# EAGLE design PCB-DISP128x32 (EAGLE 7.1.0)

## Sheet 1 of 2
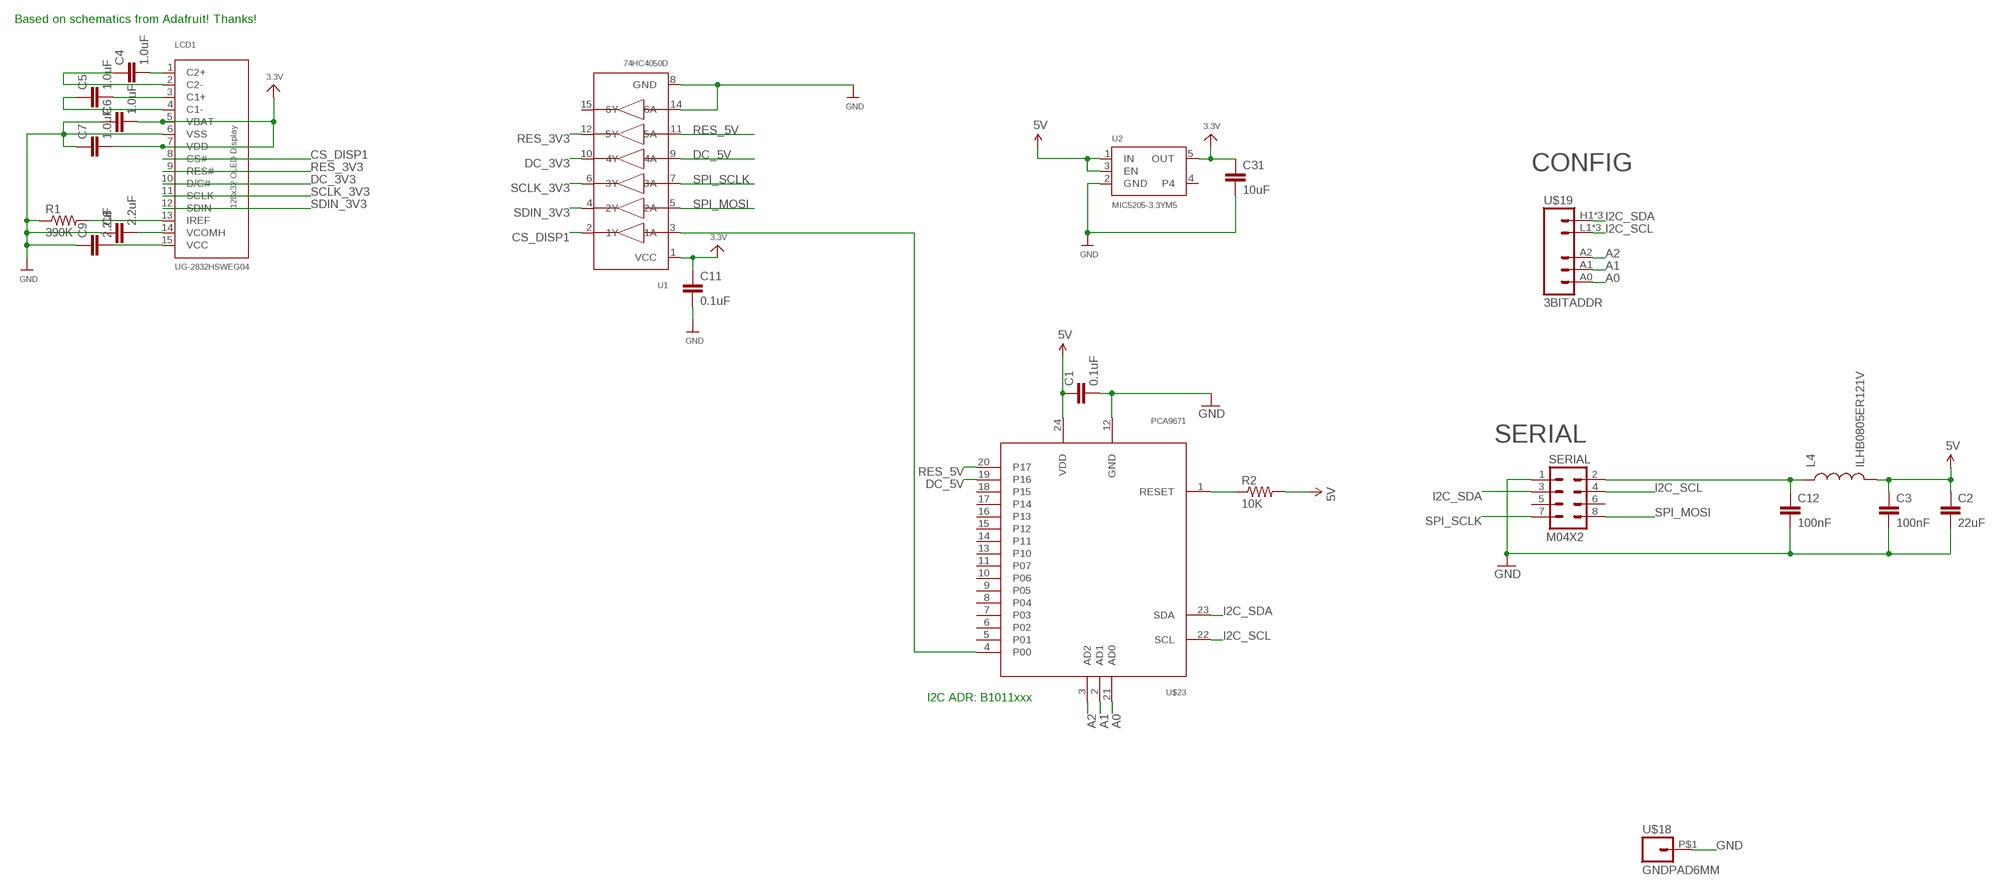
[diagram p0: schematic, sheet 1]

### Parts
C1  0.1uF  CAP0603-CAP  [0603-CAP]
C2  22uF  CAP0805  [0805]
C3  100nF  CAP0603-CAP  [0603-CAP]
C4  1.0uF  CAP0603-CAP  [0603-CAP]
C5  1.0uF  CAP0603-CAP  [0603-CAP]
C6  1.0uF  CAP0603-CAP  [0603-CAP]
C7  1.0uF  CAP0603-CAP  [0603-CAP]
C8  2.2uF  CAP0603-CAP  [0603-CAP]
C9  2.2uF  CAP0603-CAP  [0603-CAP]
C11  0.1uF  CAP0603-CAP  [0603-CAP]
C12  100nF  CAP0603-CAP  [0603-CAP]
C31  10uF  CAP0805  [0805]
L4  ILHB0805ER121V  INDUCTOR0805  [0805]
LCD1  UG-2832HSWEG04  OLED_UG-2832HSWEG04WRAPAROUND  [UG-2832HSWEG04_WRAPAROUND]
R1  390K  RESISTOR0603-RES  [0603-RES]
R2  10K  RESISTOR0603-RES  [0603-RES]
SERIAL  M04X2  [2X4]
U1  74HC4050D  74HC4050DTSSOP16  [TSSOP16]
U2  MIC5205-3.3YM5  VREG_SOT23-5  [SOT23-5]
U$18  GNDPAD6MM  [3.2MMPAD6MM]
U$19  3BITADDR  [3BITADDR]
U$23  PCA9671  [TSSOP24]

### Nets
3.3V [Power]: C6.2 C7.2 C11.1 C31.1 LCD1.5(VBAT) LCD1.7(VDD) U1.1(VCC) U2.5(OUT)
5V [Power]: C1.1 C2.1 C3.1 L4.2 R2.2 U2.1(IN) U2.3(EN) U$23.24(VDD)
A0: U$19.A0 U$23.21(AD0)
A1: U$19.A1 U$23.2(AD1)
A2: U$19.A2 U$23.3(AD2)
ARD_5V [Power]: C12.1 L4.1 SERIAL.2
CS_DISP1: LCD1.8(CS#) U1.2(1Y)
DC_3V3: LCD1.10(D/C#) U1.10(4Y)
DC_5V: U1.9(4A) U$23.19(P16)
GND [Power]: C1.2 C2.2 C3.2 C6.1 C7.1 C8.1 C9.1 C11.2 C12.2 C31.2 LCD1.6(VSS) R1.1 SERIAL.1 U1.8(GND) U1.14(6A) U2.2(GND) U$18.P$1 U$23.12(GND)
I2C_SCL: SERIAL.4 U$19.L1(GND) U$19.L2(GND) U$19.L3(GND) U$23.22(SCL)
I2C_SDA: SERIAL.3 U$19.H1(VCC) U$19.H2(VCC) U$19.H3(VCC) U$23.23(SDA)
N$1: R2.1 U$23.1(RESET)
N$2: C4.1 LCD1.2(C2-)
N$3: C4.2 LCD1.1(C2+)
N$4: C5.1 LCD1.4(C1-)
N$5 [Power]: U1.3(1A) U$23.4(P00)
N$7: C5.2 LCD1.3(C1+)
N$8: LCD1.13(IREF) R1.2
N$9: C8.2 LCD1.14(VCOMH)
N$28: C9.2 LCD1.15(VCC)
RES_3V3: LCD1.9(RES#) U1.12(5Y)
RES_5V: U1.11(5A) U$23.20(P17)
SCLK_3V3: LCD1.11(SCLK) U1.6(3Y)
SDIN_3V3: LCD1.12(SDIN) U1.4(2Y)
SPI_MOSI: SERIAL.8 U1.5(2A)
SPI_SCLK: SERIAL.7 U1.7(3A)
Unconnected: SERIAL.5 SERIAL.6 U1.15(6Y) U2.4 U$23.5(P01) U$23.6(P02) U$23.7(P03) U$23.8(P04) U$23.9(P05) U$23.10(P06) U$23.11(P07) U$23.13(P10) U$23.14(P11) U$23.15(P12) U$23.16(P13) U$23.17(P14) U$23.18(P15)

### Notes on the sheet
- Based on schematics from Adafruit! Thanks!
- CONFIG
- SERIAL
- I2C ADR: B1011xxx

## Sheet 2 of 2

## Library data of the parts
C1-C9 C11 C12 C31 = SparkFun:CAP: Capacitor Standard 0603 ceramic capacitor, and 0.1" leaded capacitor.
L4 = SparkFun:INDUCTOR: Inductors Basic Inductor/Choke - 0603 and 1206. Footprints are not proven and vary greatly between part numbers.
LCD1 = microbuilder:OLED_UG-2832HSWEG04: 128x32 SPI 0.91" Monochrome OLED Display
R1 R2 = SparkFun:RESISTOR: Resistor Basic schematic elements and footprints for 0603, 1206, and PTH resistors.
SERIAL = SparkFun:M04X2
U1 = SKAARHOJ:74HC4050D: 6-channel level shifter 74HC4050D - 2V-6V Supply Digikey: 74HC4050D,653-ND Mouser: 771-74HC4050D-T
U2 = microbuilder:VREG_SOT23-5: SOT23-5 Fixed Voltage Regulators To better organise some of the SOT23-5 fixed voltage regulators in this library, this new part was created. Part Current Out V Out V In V Dropout Digikey Part No. ADP121 150mA 3.3V 3.4-5.5V 0.09V @ 150mA ADP121-AUJZ33R7CT-ND ADP121 150mA 3.0V 3.1-5.5V 0.09V @ 150mA ADP121-AUJZ30R7CT-ND ADP122 300mA 3.3V 3.4-5.5V 0.085V @ 300mA ADP122AUJZ-3.3-R7CT-ND ADP1712 300mA 3.3V 3.5-5.5V 0.17V @ 300mA ADP1712AUJZ-3.3-R7TR-ND AP7311 (Low Cost) 150mA 3.3V 3.5-6V 0.15V @ 150mA AP7311-33WG-7DICT-ND LD39015M18R 150mA 1.8V 1.9V-5.5V 0.08V @ 100mA 497-6977-1-ND MCP1824T-3302E/OT 300mA 3.3V 3.5V-6V 0.2V @ 300mA MCP1824T-3302E/OTCT-ND MIC5205-2.5YM5 TR 150mA 2.5V 2.7-16V 0.165V @ 150mA 576-1257-2-ND MIC5205-3.0YM5 TR 150mA 3.0V 3.2V-16V 0.165V @ 150mA 576-1258-2-ND MIC5205-3.3YM5 TR 150mA 3.3V 3.5V-16V 0.165V @ 150mA 576-1259-2-ND TPS780330220 150mA 3.3V+2.2V 3.6-5.5V 250mV Max 296-23332-1-ND TDA3663/N1,135 100mA 3.3V 3.5-45V 0.18V @ 50mA 568-5343-1-ND
U$18 = SKAARHOJ:GNDPAD
U$19 = SKAARHOJ:3BITADDR
U$23 = SKAARHOJ:PCA9671

## Net classes
0 default: width 0.203 mm, drill 0.406 mm, clearance 0.152 mm
1 Power: width 0.406 mm, drill 0.61 mm, clearance 0.203 mm

## Board
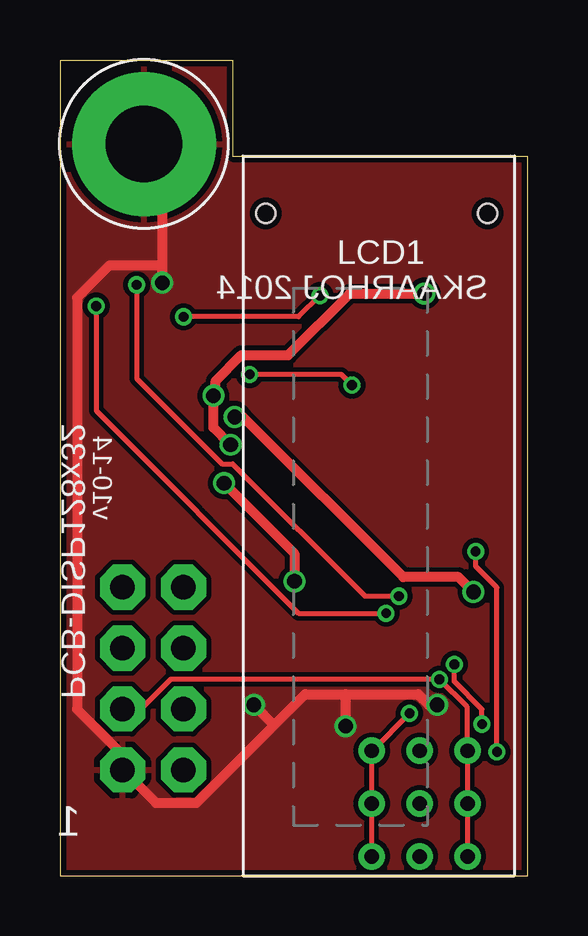
[diagram p1: board, top side]
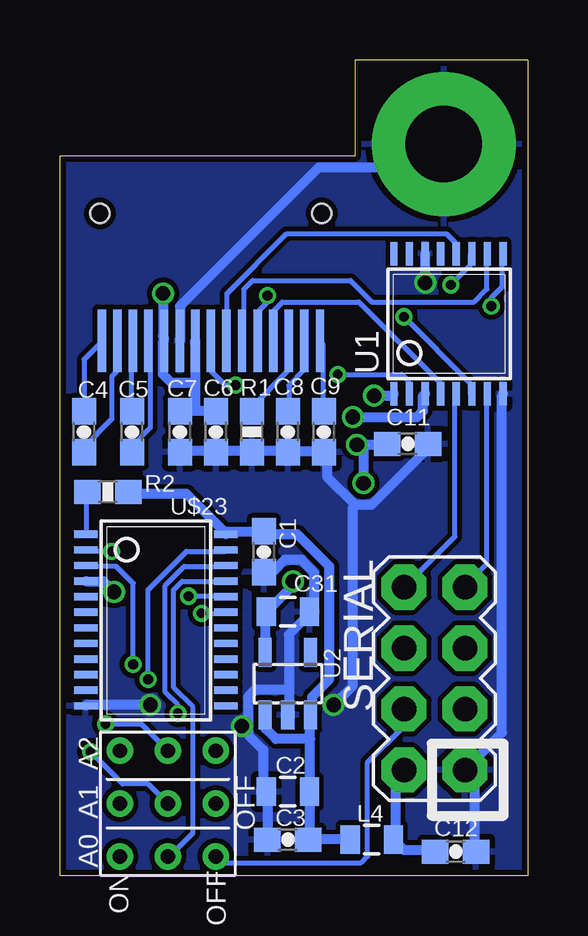
[diagram p2: board, bottom side, seen from below]

Size 19.5 x 34 mm. Coordinates in mm from the lower left corner, seen from the top.
Outline: 19.5,0 19.5,30 7.21,30 7.21,34 0,34 0,0 19.5,0
Copper layers (1*16): Top 0.035mm / dielectric 1.5mm / Bottom 0.035mm
Design rules "Fusion_eagle_rule_v1.1": minimum track width 6mil, minimum drill 12mil, track to track 6mil, track to pad 6mil, pad to pad 6mil, via to via 6mil, smd to smd 0mil, copper to edge 10mil, drill to drill 10mil, minimum pad ring 10mil, minimum via ring 6mil, stop-mask expansion 2mil, vias tented up to drill 100mil, thermal gap 10mil

### Footprints (pad centres in the part's own frame; a part is rotated, then mirrored left to right if it is on the bottom)
0603-CAP = smd 1.1 x 1: 1 -0.85,0; 2 0.85,0
0805 = smd 0.8 x 1.2: 1 -0.9,0; 2 0.9,0
UG-2832HSWEG04_WRAPAROUND = smd 2.6 x 0.35 bottom: 1 -7.7,-4.55; 2 -7.7,-3.9; 3 -7.7,-3.25; 4 -7.7,-2.6; 5 -7.7,-1.95; 6 -7.7,-1.3; 7 -7.7,-0.65; 8 -7.7,0; 9 -7.7,0.65; 10 -7.7,1.3; 11 -7.7,1.95; 12 -7.7,2.6; 13 -7.7,3.25; 14 -7.7,3.9; 15 -7.7,4.55 | hole 0.8: -2.4,4.625; -2.4,-4.625
0603-RES = smd 1.1 x 1: 1 -0.85,0; 2 0.85,0
2X4 = drill 1.016 pad 1.88 octagon: 1 -3.81,-1.27; 2 -3.81,1.27; 3 -1.27,-1.27; 4 -1.27,1.27; 5 1.27,-1.27; 6 1.27,1.27; 7 3.81,-1.27; 8 3.81,1.27
TSSOP16 = smd 0.305 x 0.991: 1 -3.575,-2.918; 2 -2.925,-2.918; 3 -2.275,-2.918; 4 -1.625,-2.918; 5 -0.975,-2.918; 6 -0.325,-2.918; 7 0.325,-2.918; 8 0.975,-2.918; 9 0.975,2.918; 10 0.325,2.918; 11 -0.325,2.918; 12 -0.975,2.918; 13 -1.625,2.918; 14 -2.275,2.918; 15 -2.925,2.918; 16 -3.575,2.918
SOT23-5 = smd 0.55 x 1.2: 1 -0.95,-1.3; 2 0,-1.3; 3 0.95,-1.3; 4 0.95,1.3; 5 -0.95,1.3
3.2MMPAD6MM = drill 3.2 pad 6: P$1 0,0
3BITADDR = drill 0.6: A0 -2.2,0; A1 0,0; A2 2.2,0; H1 -2.2,2; H2 0,2; H3 2.2,2; L1 -2.2,-2; L2 0,-2; L3 2.2,-2
TSSOP24 = smd 0.305 x 0.991: 1 -4.225,-2.918; 2 -3.575,-2.918; 3 -2.925,-2.918; 4 -2.275,-2.918; 5 -1.625,-2.918; 6 -0.975,-2.918; 7 -0.325,-2.918; 8 0.325,-2.918; 9 0.975,-2.918; 10 1.625,-2.918; 11 2.275,-2.918; 12 2.925,-2.918; 13 2.925,2.918; 14 2.275,2.918; 15 1.625,2.918; 16 0.975,2.918; 17 0.325,2.918; 18 -0.325,2.918; 19 -0.975,2.918; 20 -1.625,2.918; 21 -2.275,2.918; 22 -2.925,2.918; 23 -3.575,2.918; 24 -4.225,2.918

### Placement (x,y rotation side)
C1  11,13.5 270 bottom
C2  10,3.5 180 bottom
C3  10,1.5 180 bottom
C4  18.5,18.5 90 bottom
C5  16.5,18.5 90 bottom
C6  13,18.5 90 bottom
C7  14.5,18.5 90 bottom
C8  10,18.5 90 bottom
C9  8.5,18.5 90 bottom
C11  5,18 0 bottom
C12  3,1 0 bottom
C31  10,11 0 bottom
L4  6.5,1.5 180 bottom
LCD1  13.21,30 90 top
R1  11.5,18.5 90 bottom
R2  17.5,16 0 bottom
SERIAL  3.88,8.21 90 bottom
U1  2,23 0 bottom
U2  10,8 0 bottom
U$18  3.5,30.5 0 top
U$19  15,3 90 bottom
U$23  15.5,10 270 bottom

### Tracks (layer width: path | path; a pad name or v marks a point on that pad's centre or on a via)
3.3V  (via drill 0.61)
  Top 0.406: v7.11,17.96 6.4,18.67 v6.4,20 6.49,20.18 6.49,20.62 7.56,21.69 9.51,21.69 12.09,24.27 v15.2,24.27 | v9.78,12.27 9.78,13.42 v6.84,16.36
  Bottom 0.406: 13.87,19.38 14.49,19.38 C7.2 | 13.87,19.38 13.07,19.38 C6.2 | 13.87,20.54 13.87,22.23 LCD1.7 | 13.87,20.54 13.87,19.38 | 13.87,20.54 14.85,20.54 15.2,20.89 15.2,22.23 LCD1.5 15.2,22.49 v15.2,24.27 | U2.5 10.94,9.34 10.94,10.94 C31.1 10.76,11.11 9.78,12.09 v9.78,12.27 | v6.4,20 5.6,20 U1.1 | C11.1 5.87,17.96 v7.11,17.96 6.84,17.78 v6.84,16.36
5V
  Bottom 0.406: 12.54,14.31 11.02,14.31 C1.1 10.85,14.22 9.6,14.22 8.27,12.89 8.27,8.18 8.98,7.47 8.98,6.84 U2.3 9.07,6.67 9.07,5.69 | 12.54,14.31 U$23.24 | R2.2 16.62,15.91 14.22,15.91 12.71,14.4 12.54,14.31 | L4.2 7.47,1.51 9.07,1.51 C3.1 9.07,1.69 9.07,3.47 C2.1 9.07,3.65 9.07,5.69 | 9.07,5.69 10.49,5.69 10.94,6.13 10.94,6.67 U2.1
A0
  Bottom 0.203: U$23.21 12.62,12.27 14.4,12.27 14.76,11.91 14.76,7.82 13.96,7.02 13.96,1.78 14.94,0.8 U$19.A0
A1  (via drill 0.41)
  Top 0.203: v17.34,13.51 17.34,12.89 18.22,12 v18.22,5.16
  Bottom 0.203: v17.34,13.51 18.4,13.51 U$23.2 | v18.22,5.16 16.89,3.82 15.82,3.82 15.02,3.02 U$19.A1
A2  (via drill 0.41)
  Top 0.203: v16.45,8.8 16.45,8.09 17.6,6.93 v17.6,6.31
  Bottom 0.203: v16.45,8.8 16.45,12.18 17.16,12.89 18.4,12.89 U$23.3 | v17.6,6.31 16.09,6.31 15.02,5.25 U$19.A2
ARD_5V
  Bottom 0.406: C12.1 3.91,1.07 5.16,1.07 5.51,1.42 L4.1 5.51,1.69 5.51,4 5.16,4.36 SERIAL.2
CS_DISP1  (via drill 0.41)
  Top 0.203: v7.91,20.89 11.73,20.89 v12.18,20.45
  Bottom 0.203: v7.91,20.89 5.25,20.89 4.98,20.62 4.98,20.09 U1.2 | v12.18,20.45 12.62,20.45 13.16,20.98 13.16,22.23 LCD1.8
DC_3V3
  Bottom 0.203: U1.10 1.69,25.87 1.69,24.45 2.22,23.91 6.49,23.91 7.38,24.8 11.47,24.8 11.82,24.45 11.82,22.31 LCD1.10
DC_5V  (via drill 0.41)
  Top 0.203: v13.6,10.94 9.96,10.94 1.51,19.38 v1.51,23.74
  Bottom 0.203: v13.6,10.94 12.62,10.94 U$23.19 | v1.51,23.74 1.51,24.09 1.07,24.54 1.07,25.87 U1.9
GND  (via drill 0.61)
  Top 0.406: v15.73,7.11 15.38,7.11 14.94,7.56 11.91,7.56 | 11.91,7.56 10.22,7.56 8.93,6.27 | 8.93,6.27 5.69,3.02 4,3.02 2.67,4.36 SERIAL.1 2.49,4.53 2.49,5.16 0.71,6.93 0.71,24.09 2.04,25.43 4.27,25.43 | 8.93,6.27 v8.09,7.11 | 11.91,7.56 v11.91,6.22 | 4.27,25.43 4.27,29.78 3.56,30.49 U$18.P$1 | 4.27,25.43 v4.27,24.71
  Bottom 0.406: C3.2 10.85,3.47 C2.2 11.02,3.65 11.02,5.25 11.65,5.87 11.65,6.22 | C1.2 10.94,12.71 10.58,12.71 10.13,13.16 9.42,13.16 8.89,12.62 8.89,11.2 9.07,11.02 C31.2 9.16,10.85 9.96,10.05 9.96,7.73 | 9.96,7.73 9.96,6.76 U2.2 | 11.65,6.22 11.65,7.47 11.38,7.73 9.96,7.73 | 7.2,15.47 6.49,15.47 4.18,17.78 4.18,17.96 C11.2 | 7.2,15.47 8.36,16.62 8.36,17.51 C9.1 8.53,17.69 9.96,17.69 C8.1 10.13,17.69 11.47,17.69 R1.1 11.65,17.69 12.98,17.69 C6.1 13.16,17.69 14.49,17.69 C7.1 | U1.8 1.07,20 1.07,5.96 2.58,4.45 SERIAL.1 2.49,4.27 2.22,4 2.22,1.07 C12.2 | v15.73,7.11 18.4,7.11 U$23.12 | v8.09,7.11 7.29,7.91 7.29,15.29 7.2,15.47 | v11.91,6.22 11.65,6.22 | v4.27,24.71 4.27,25.87 U1.14 | LCD1.6 14.49,22.31 14.49,23.74 8.71,29.52 4.53,29.52 3.56,30.49 U$18.P$1
  pour Bottom: 0,0 20,0 20,34 0,34
  pour Top: 0,0 20,0 20,34 0,34
I2C_SCL  (via drill 0.41)
  Top 0.203: U$19.L1 12.98,0.8 12.98,2.93 U$19.L2 12.98,3.02 12.98,5.16 U$19.L3 13.07,5.25 v14.58,6.76
  Bottom 0.203: v14.58,6.76 14.58,7.11 15.11,7.64 15.11,12.09 14.31,12.89 12.62,12.89 U$23.22 | SERIAL.4 5.16,6.22 6.67,4.71 6.67,0.8 6.93,0.53 12.8,0.53 12.98,0.71 U$19.L1
I2C_SDA  (via drill 0.41)
  Top 0.203: U$19.H1 16.98,0.8 16.98,2.93 U$19.H2 16.98,3.02 16.98,5.16 U$19.H3 16.98,5.25 16.98,7.02 v15.82,8.18 4.62,8.18 3.47,7.02 2.67,7.02 SERIAL.3
  Bottom 0.203: v15.82,8.18 15.82,11.91 14.22,13.51 12.62,13.51 U$23.23
N$1
  Bottom 0.203: U$23.1 18.4,14.31 18.4,15.91 R2.1
N$2
  Bottom 0.203: C4.1 18.49,17.69 18.49,17.87 17.34,19.02 17.34,20.8 17.16,20.98 17.16,22.23 LCD1.2
N$3
  Bottom 0.203: C4.2 18.49,19.38 18.49,21.51 17.78,22.23 LCD1.1
N$4
  Bottom 0.203: C5.1 16.45,17.69 16.45,17.96 15.73,18.67 15.73,22.23 LCD1.4
N$5  (via drill 0.61)
  Top 0.406: v7.29,19.11 7.64,19.11 14.31,12.45 16.62,12.45 v17.25,11.82
  Bottom 0.406: v7.29,19.11 4.62,19.11 4.36,19.38 4.36,20 U1.3 | v17.25,11.82 17.69,12.27 18.4,12.27 U$23.4
N$7
  Bottom 0.203: C5.2 16.54,19.38 16.54,22.23 LCD1.3
N$8
  Bottom 0.203: R1.2 11.47,19.38 11.47,19.56 10.05,20.98 10.05,22.23 LCD1.13
N$9
  Bottom 0.203: C8.2 9.96,19.38 9.96,20.45 9.34,21.07 9.34,22.23 LCD1.14
N$28
  Bottom 0.203: C9.2 8.53,19.38 8.53,22.14 8.62,22.23 LCD1.15
RES_3V3
  Bottom 0.203: U1.12 3.02,25.96 3.02,26.4 3.38,26.76 10.05,26.76 12.54,24.27 12.54,22.31 LCD1.9
RES_5V  (via drill 0.41)
  Top 0.203: v14.13,11.65 12.71,11.65 7.2,17.16 6.76,17.16 3.2,20.71 v3.2,24.62
  Bottom 0.203: v14.13,11.65 12.62,11.65 U$23.20 | v3.2,24.62 2.4,25.43 2.4,25.87 U1.11
SCLK_3V3  (via drill 0.41)
  Top 0.203: v5.16,23.29 9.96,23.29 v10.85,24.18
  Bottom 0.203: v5.16,23.29 2.4,20.54 2.4,20.09 U1.6 | v10.85,24.18 10.85,23.91 11.2,23.56 11.2,22.31 LCD1.11
SDIN_3V3
  Bottom 0.203: U1.4 3.65,20.09 3.65,20.54 7.02,23.91 10.22,23.91 10.58,23.56 10.58,22.31 LCD1.12
SPI_MOSI
  Bottom 0.203: U1.5 3.02,20 3.02,14.13 5.07,12.09 SERIAL.8
SPI_SCLK
  Bottom 0.203: U1.7 1.69,20 1.69,12.98 2.58,12.09 SERIAL.7

### Text on the board
_tsilk: SKAARHOJ 2014 | PCB-DISP128x32 | v10-14 | 1
_bsilk: OFF